# EAGLE design Noduino-iBaihe (EAGLE 6.6.0)
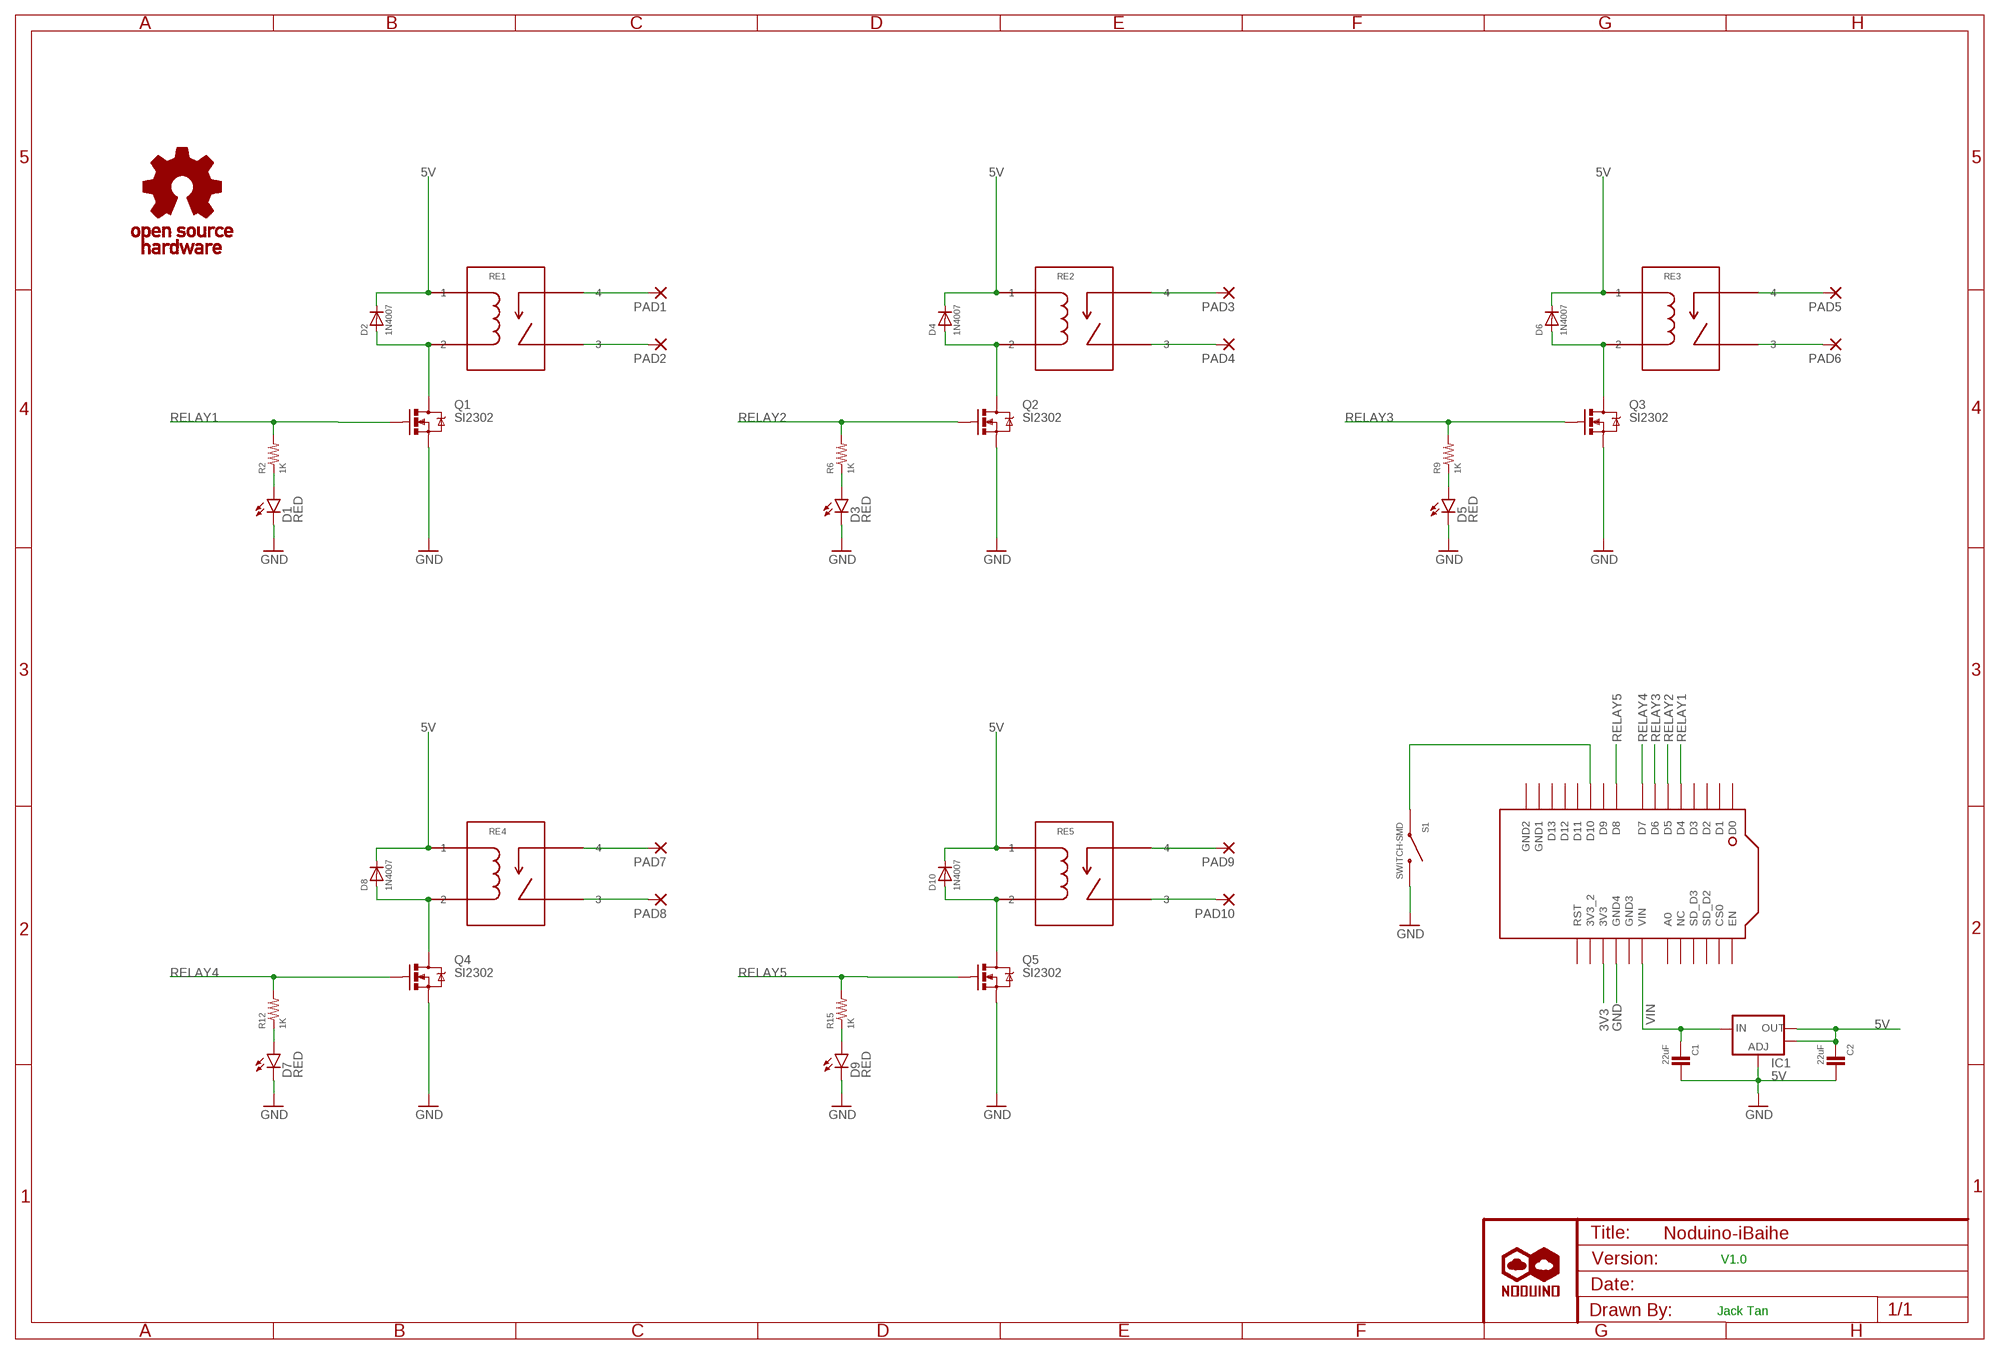
[diagram p0: schematic, sheet 1]

## Parts
C1  22uF  1206-CAP  [C1206]
C2  22uF  1206-CAP  [C1206]
D1  RED  LED-RED0603  [LED-0603]
D2  1N4007  DIODESOD  [SOD-323]
D3  RED  LED-RED0603  [LED-0603]
D4  1N4007  DIODESOD  [SOD-323]
D5  RED  LED-RED0603  [LED-0603]
D6  1N4007  DIODESOD  [SOD-323]
D7  RED  LED-RED0603  [LED-0603]
D8  1N4007  DIODESOD  [SOD-323]
D9  RED  LED-RED0603  [LED-0603]
D10  1N4007  DIODESOD  [SOD-323]
IC1  5V  AMS1117SOT223  [SOT223]
N1  NODUINO-PINMAIL  [NODUINO-PIN-MAIL]
PAD1  2,15/1,0  [2,15/1,0]
PAD2  2,15/1,0  [2,15/1,0]
PAD3  2,15/1,0  [2,15/1,0]
PAD4  2,15/1,0  [2,15/1,0]
PAD5  2,15/1,0  [2,15/1,0]
PAD6  2,15/1,0  [2,15/1,0]
PAD7  2,15/1,0  [2,15/1,0]
PAD8  2,15/1,0  [2,15/1,0]
PAD9  2,15/1,0  [2,15/1,0]
PAD10  2,15/1,0  [2,15/1,0]
Q1  SI2302  MOSFET-N-SMD  [SOT23-3]
Q2  SI2302  MOSFET-N-SMD  [SOT23-3]
Q3  SI2302  MOSFET-N-SMD  [SOT23-3]
Q4  SI2302  MOSFET-N-SMD  [SOT23-3]
Q5  SI2302  MOSFET-N-SMD  [SOT23-3]
R2  1K  0603-RESISTOR  [0603-RES]
R6  1K  0603-RESISTOR  [0603-RES]
R9  1K  0603-RESISTOR  [0603-RES]
R12  1K  0603-RESISTOR  [0603-RES]
R15  1K  0603-RESISTOR  [0603-RES]
RE1  HKE-HRS3FNH  [HKE-HRS3FN]
RE2  HKE-HRS3FNH  [HKE-HRS3FN]
RE3  HKE-HRS3FNH  [HKE-HRS3FN]
RE4  HKE-HRS3FNH  [HKE-HRS3FN]
RE5  HKE-HRS3FNH  [HKE-HRS3FN]
S1  SWITCH-SMD  [TACTILE-SWITCH-1101NE]
U$1  NODUINO-LOGO-ALL  [NODUINO-ALL-1]
U$2  OPEN_HARDWARE_LOGO  [OPEN_HARDWARE_LOGO]

## Nets
3V3: N1.P$26(3V3)
5V: C2.1 D2.1(C) D4.1(C) D6.1(C) D8.1(C) D10.1(C) IC1.2(OUT) IC1.4(OUT) RE1.1 RE2.1 RE3.1 RE4.1 RE5.1
GND: C1.2 C2.2 D1.C D3.C D5.C D7.C D9.C IC1.1(ADJ) N1.P$25(GND4) Q1.2(S) Q2.2(S) Q3.2(S) Q4.2(S) Q5.2(S) S1.P$1
N$2: D2.2(A) Q1.3(D) RE1.2
N$3: PAD1.1(P) RE1.4
N$4: D1.A R2.1
N$5: PAD2.1(P) RE1.3
N$7: D3.A R6.1
N$8: D4.2(A) Q2.3(D) RE2.2
N$9: PAD3.1(P) RE2.4
N$10: PAD4.1(P) RE2.3
N$12: D5.A R9.1
N$13: D6.2(A) Q3.3(D) RE3.2
N$14: PAD5.1(P) RE3.4
N$15: PAD6.1(P) RE3.3
N$17: D7.A R12.1
N$18: D8.2(A) Q4.3(D) RE4.2
N$19: PAD7.1(P) RE4.4
N$20: PAD8.1(P) RE4.3
N$22: D9.A R15.1
N$23: D10.2(A) Q5.3(D) RE5.2
N$24: PAD9.1(P) RE5.4
N$25: PAD10.1(P) RE5.3
N$29: N1.P$11(D10) S1.P$2
RELAY1: N1.P$5(D4) Q1.1(G) R2.2
RELAY2: N1.P$6(D5) Q2.1(G) R6.2
RELAY3: N1.P$7(D6) Q3.1(G) R9.2
RELAY4: N1.P$8(D7) Q4.1(G) R12.2
RELAY5: N1.P$9(D8) Q5.1(G) R15.2
VIN: C1.1 IC1.3(IN) N1.P$23(VIN)
Unconnected: N1.P$1(D0) N1.P$2(D1) N1.P$3(D2) N1.P$4(D3) N1.P$10(D9) N1.P$12(D11) N1.P$13(D12) N1.P$14(D13) N1.P$15(GND1) N1.P$16(GND2) N1.P$17(EN) N1.P$18(CS0) N1.P$19(SD_D2) N1.P$20(SD_D3) N1.P$21(NC) N1.P$22(A0) N1.P$24(GND3) N1.P$27(3V3_2) N1.P$28(RST)

## Notes on the sheet
- V1.0
- Jack Tan

## Library data of the parts
C1 C2 = ehl:1206-CAP
D1 D3 D5 D7 D9 = ehl:LED-RED: Assorted Red LEDs LilyPad 1206- DIO-09912 1206- DIO-00809 0603- DIO-00819; PROD_ID: DIO-00819
D2 D4 D6 D8 D10 = ehl:DIODE: Diode These are standard reverse protection diodes and small signal diodes. SMA package can handle up to about 1A. SOD-323 can handle about 200mA. What the SOD-323 package when ordering, there are some mfgs out there that are 5-pin packages.
IC1 = ehl:AMS1117: Voltage Regulator LM1117 Standard adjustable voltage regulator but in SMD form. Spark Fun Electronics SKU : COM-00595
N1 = ehl:NODUINO-PIN
PAD1-PAD10 = ehl:2,15/1,0: THROUGH-HOLE PAD
Q1-Q5 = ehl:MOSFET-N
R2 R6 R9 R12 R15 = ehl:0603-RESISTOR
RE1-RE5 = ehl:HKE-HRS3FNH
S1 = ehl:SWITCH-SMD
U$1 = ehl:NODUINO-LOGO-ALL
U$2 = ehl:OPEN_HARDWARE_LOGO

## Board
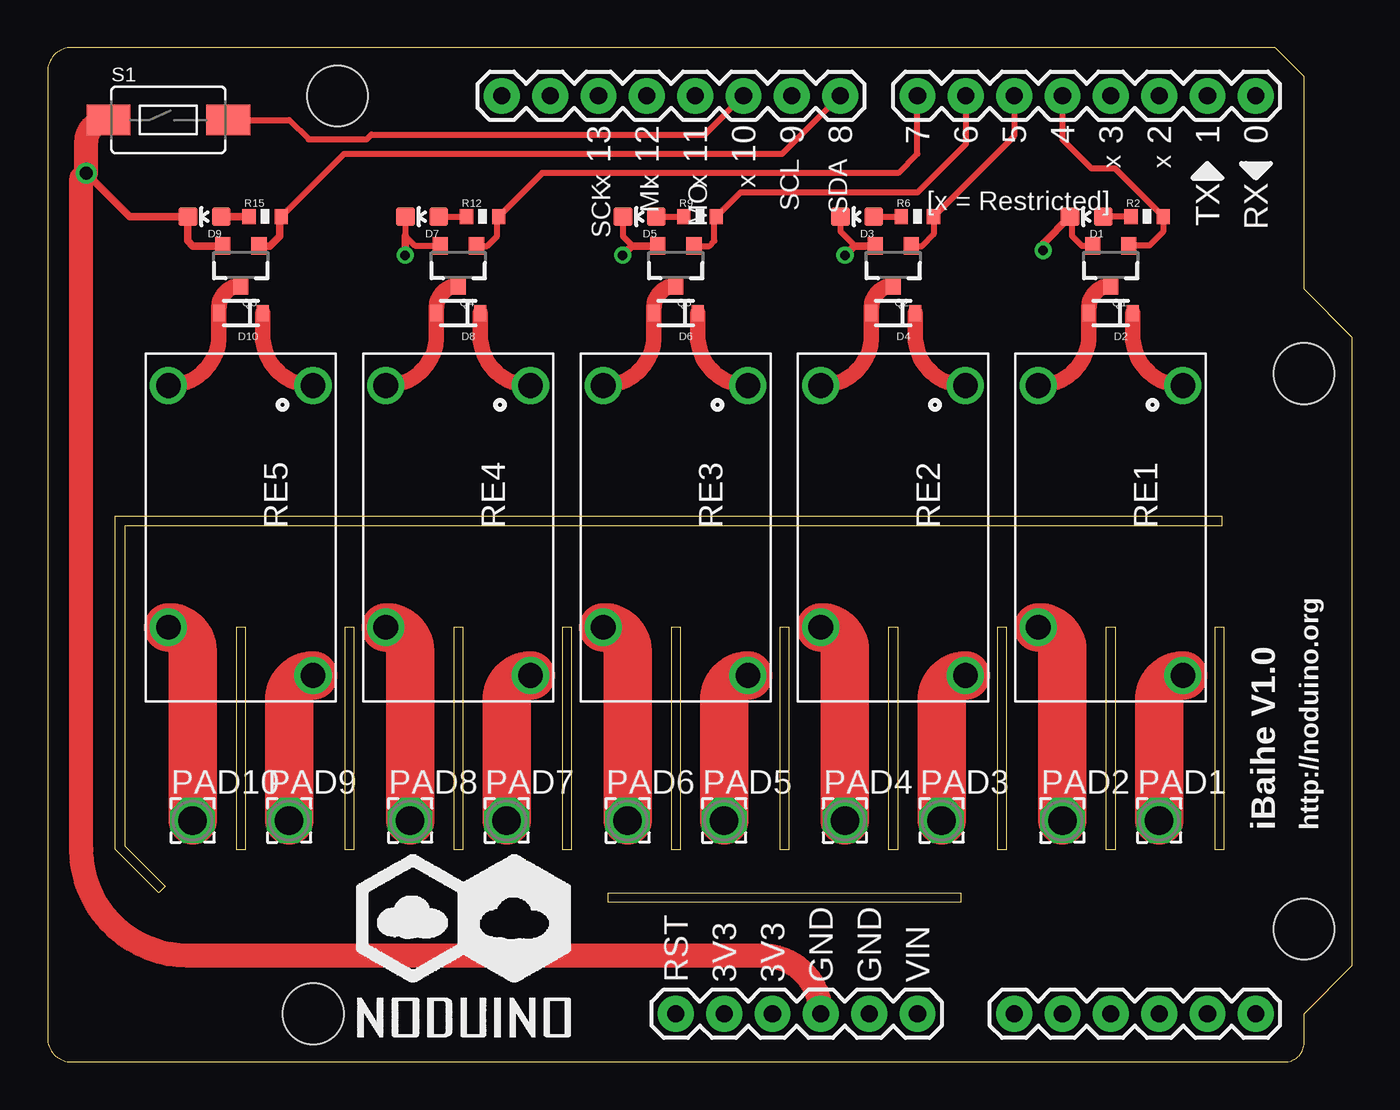
[diagram p1: board, top side]
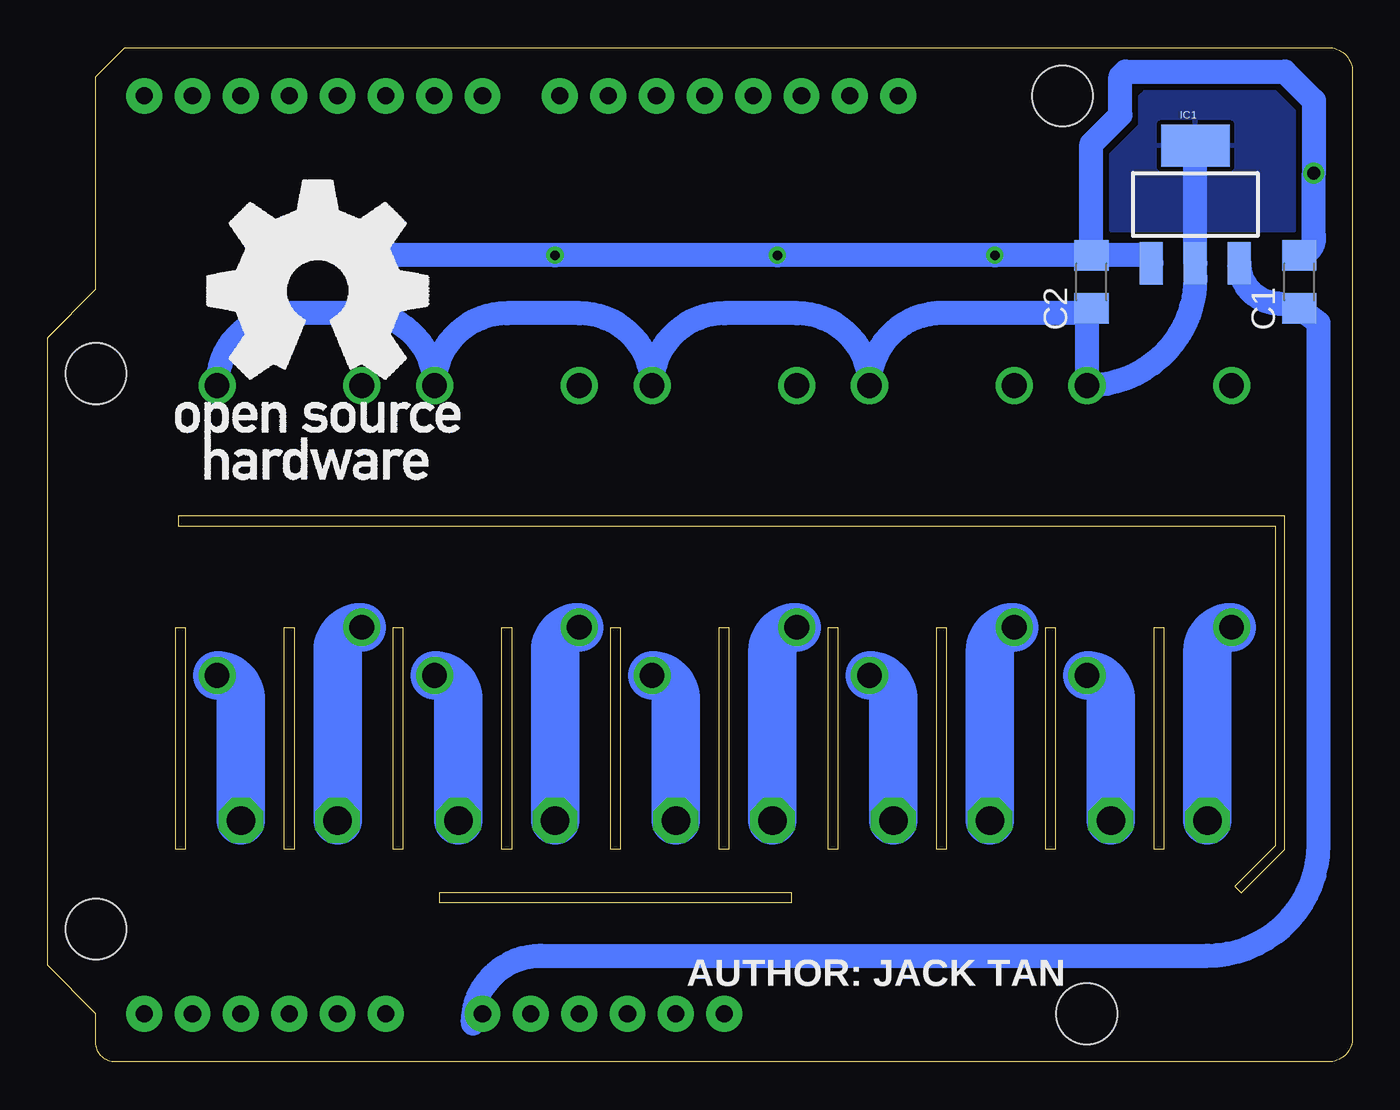
[diagram p2: board, bottom side, seen from below]

Size 68.58 x 53.34 mm. Coordinates in mm from the lower left corner, seen from the top.
Copper layers (1*16): Top 0.035mm / dielectric 1.5mm / Bottom 0.035mm
Design rules "jackslab-camgo": minimum track width 6mil, minimum drill 12mil, track to track 8mil, track to pad 8mil, pad to pad 8mil, via to via 8mil, smd to smd 6mil, copper to edge 8mil, drill to drill 8mil, minimum pad ring 10mil, minimum via ring 8mil, stop-mask expansion 4mil, vias tented up to drill 20mil, thermal gap 10mil
Milling: 52 lines

### Footprints (pad centres in the part's own frame; a part is rotated, then mirrored left to right if it is on the bottom)
C1206 = smd 1.6 x 1.8: 1 -1.4,0; 2 1.4,0
LED-0603 = smd 1 x 1: A 0,-0.877; C 0,0.877
SOD-323 = smd 0.63 x 0.83: 1 -1.15,0; 2 1.15,0
SOT223 = smd 1.219 x 2.235: 1 -2.311,-3.099; 2 0,-3.099; 3 2.311,-3.099 | smd 3.6 x 2.2: 4 0,3.099
NODUINO-PIN-MAIL = drill 0.9 pad 1.88: P$1 63.5,50.8; P$2 60.96,50.8; P$3 58.42,50.8; P$4 55.88,50.8; P$5 53.34,50.8; P$6 50.8,50.8; P$7 48.26,50.8; P$8 45.72,50.8; P$9 41.656,50.8; P$10 39.116,50.8; P$11 36.576,50.8; P$12 34.036,50.8; P$13 31.496,50.8; P$14 28.956,50.8; P$15 26.416,50.8; P$16 23.876,50.8; P$17 63.5,2.54; P$18 60.96,2.54; P$19 58.42,2.54; P$20 55.88,2.54; P$21 53.34,2.54; P$22 50.8,2.54; P$23 45.72,2.54; P$24 43.18,2.54; P$25 40.64,2.54; P$26 38.1,2.54; P$27 35.56,2.54; P$28 33.02,2.54 | hole 3.2: 66.04,6.985; 66.04,36.195; 15.24,50.8; 13.97,2.54
2,15/1,0 = drill 1.5 pad 2.35 octagon: 1 0,0
SOT23-3 = smd 0.8 x 0.9: 1 -0.95,-1; 2 0.95,-1; 3 0,1.1
0603-RES = smd 0.7 x 0.8: 1 -0.85,0; 2 0.85,0
HKE-HRS3FN = drill 1.3: 1 0,7.6; 2 0,0; 3 12.7,0; 4 15.24,7.6
TACTILE-SWITCH-1101NE = smd 2.3 x 1.6: P$1 -3.15,0; P$2 3.15,0

### Placement (x,y rotation side)
C1  2.79,41.02 90 bottom
C2  13.72,41.02 90 bottom
D1  54.61,44.45 90 top
D2  55.88,39.37 180 top
D3  42.55,44.45 90 top
D4  44.45,39.37 180 top
D5  31.11,44.45 90 top
D6  33.02,39.37 180 top
D7  19.68,44.45 90 top
D8  21.59,39.37 180 top
D9  8.26,44.45 90 top
D10  10.16,39.37 180 top
IC1  8.26,45.09 0 bottom
N1  0,0 0 top
PAD1  58.42,12.7 0 top
PAD2  53.34,12.7 0 top
PAD3  46.99,12.7 0 top
PAD4  41.91,12.7 0 top
PAD5  35.56,12.7 0 top
PAD6  30.48,12.7 0 top
PAD7  24.13,12.7 0 top
PAD8  19.05,12.7 0 top
PAD9  12.7,12.7 0 top
PAD10  7.62,12.7 0 top
Q1  55.88,41.91 180 top
Q2  44.45,41.91 180 top
Q3  33.02,41.91 180 top
Q4  21.59,41.91 180 top
Q5  10.16,41.91 180 top
R2  57.78,44.45 0 top
R6  45.72,44.45 0 top
R9  34.29,44.45 0 top
R12  22.86,44.45 0 top
R15  11.43,44.45 0 top
RE1  52.07,35.56 270 top
RE2  40.64,35.56 270 top
RE3  29.21,35.56 270 top
RE4  17.78,35.56 270 top
RE5  6.35,35.56 270 top
S1  6.35,49.53 0 top
U$1  15.88,0.64 0 top
U$2  61.87,30.62 0 bottom

### Tracks (layer width: path | path; a pad name or v marks a point on that pad's centre or on a via)
5V
  Top 0.813: D10.1 11.31,38.2 arc90 RE5.1 | D2.1 57.03,38.2 arc90 RE1.1 | D8.1 22.74,38.2 arc90 RE4.1 | D6.1 34.17,38.2 arc90 RE3.1 | D4.1 45.6,38.2 arc90 RE2.1
  Bottom 1.016: IC1.2 8.26,41.26
  Bottom 1.27: 8.26,41.26 arc90 RE5.1 13.95,39.39 | IC1.2 IC1.4 | 13.95,39.39 C2.1 | 13.95,39.39 21.55,39.39 arc-90 RE4.1 arc-90 29.19,39.37 33,39.37 arc-90 RE3.1 arc-90 40.62,39.37 44.43,39.37 arc-90 RE2.1 arc-90 52.05,39.37 55.86,39.37 arc-90 RE1.1
  pour Bottom: 3.05,43.69 12.7,43.69 12.7,47.75 11.18,49.28 11.18,50.8 10.92,51.05 4.06,51.05 3.05,50.04
GND  (via drill 0.5, 0.7)
  Top 0.305: Q1.2 54.37,42.91 53.85,43.43 53.85,44.34 D1.C | D3.C 41.67,43.68 42.42,42.93 43.48,42.93 Q2.2 | D7.C 18.81,43.42 19.3,42.93 20.62,42.93 Q4.2 | D5.C 30.24,43.42 30.73,42.93 32.05,42.93 Q3.2
  Top 0.406: v2.03,46.74 4.32,44.45 D9.C 7.37,44.44 7.37,43.18 7.64,42.91 Q5.2 | v52.32,42.67 52.32,43.04 D1.C | Q2.2 42.4,42.91 v41.91,42.42 | Q3.2 30.71,42.91 v30.23,42.42 | 18.81,43.42 18.81,42.43 v18.8,42.42
  Top 1.27: N1.P$25 arc90 37.59,5.59 7.37,5.59 arc-90 1.78,11.18 1.78,46.48 v2.03,46.74 2.03,48.36 arc-90 S1.P$1
  Bottom 1.27: C1.2 arc-90 2.03,43.44 v2.03,46.74 2.03,50.55 3.56,52.07 11.94,52.07 12.19,51.82 12.19,49.78 13.72,48.26 C2.2 | IC1.1 arc-90 11,42.42 C2.2 | C2.2 v18.8,42.42 v30.23,42.42 v41.91,42.42 52.07,42.42 v52.32,42.67
N$2
  Top 0.813: RE1.2 arc90 54.73,38.22 D2.2 54.73,39.66 arc-90 Q1.3
N$3
  Top 2.54: 59.69,20.32 arc90 58.42,19.05 PAD1.1
  Bottom 2.54: RE1.4 arc90 58.42,19.07 PAD1.1
N$4
  Top 0.305: R2.1 D1.A
N$5
  Top 2.54: RE1.3 arc-90 53.34,21.59 PAD2.1
  Bottom 2.54: RE1.3 arc-90 53.34,21.59 PAD2.1
N$7
  Top 0.305: D3.A R6.1
N$8
  Top 0.813: RE2.2 arc90 43.3,38.22 D4.2 43.3,39.66 arc-90 Q2.3
N$9
  Top 2.54: 48.26,20.32 arc90 46.99,19.05 PAD3.1
  Bottom 2.54: RE2.4 arc90 46.99,19.07 PAD3.1
N$10
  Top 2.54: RE2.3 arc-90 41.91,21.59 PAD4.1
  Bottom 2.54: RE2.3 arc-90 41.91,21.59 PAD4.1
N$12
  Top 0.305: D5.A R9.1
N$13
  Top 0.813: RE3.2 arc90 31.87,38.22 D6.2 31.87,39.66 arc-90 Q3.3
N$14
  Top 2.54: 36.83,20.32 arc90 35.56,19.05 PAD5.1
  Bottom 2.54: RE3.4 arc90 35.56,19.07 PAD5.1
N$15
  Top 2.54: RE3.3 arc-90 30.48,21.59 PAD6.1
  Bottom 2.54: RE3.3 arc-90 30.48,21.59 PAD6.1
N$17
  Top 0.305: D7.A R12.1
N$18
  Top 0.813: RE4.2 arc90 20.44,38.22 D8.2 20.44,39.66 arc-90 Q4.3
N$19
  Top 2.54: 25.4,20.32 arc90 24.13,19.05 PAD7.1
  Bottom 2.54: RE4.4 arc90 24.13,19.07 PAD7.1
N$20
  Top 2.54: RE4.3 arc-90 19.05,21.59 PAD8.1
  Bottom 2.54: RE4.3 arc-90 19.05,21.59 PAD8.1
N$22
  Top 0.406: D9.A R15.1
N$23
  Top 0.813: RE5.2 arc90 9.01,38.22 D10.2 9.01,39.66 arc-90 Q5.3
N$24
  Top 2.54: 13.97,20.32 arc90 12.7,19.05 PAD9.1
  Bottom 2.54: RE5.4 arc90 12.7,19.07 PAD9.1
N$25
  Top 2.54: RE5.3 arc-90 7.62,21.59 PAD10.1
  Bottom 2.54: RE5.3 arc-90 7.62,21.59 PAD10.1
N$29
  Top 0.305: S1.P$2 12.7,49.53 13.72,48.51 16.76,48.51 17.02,48.77 34.54,48.77 N1.P$11
RELAY1
  Top 0.305: Q1.1 56.85,42.93 57.91,42.93 58.63,43.65 R2.2 56.09,46.99 54.86,46.99 53.34,48.51 N1.P$5
RELAY2
  Top 0.305: N1.P$6 50.8,48.68 R6.2 46.57,43.52 45.96,42.91 Q2.1
RELAY3
  Top 0.305: N1.P$7 48.26,48.26 45.72,45.72 36.41,45.72 R9.2 35.05,44.36 35.05,43.18 34.78,42.91 Q3.1
RELAY4
  Top 0.305: Q4.1 23.1,42.91 23.62,43.43 23.62,44.36 R12.2 26,46.74 44.7,46.74 45.72,47.75 N1.P$8
RELAY5
  Top 0.305: R15.2 15.58,47.75 38.61,47.75 N1.P$9
  Top 0.406: Q5.1 11.67,42.91 12.19,43.43 12.19,44.36 R15.2
VIN
  Bottom 0.406: 5.86,41.91 5.86,41.93 6.1,42.16 6.1,42.14 IC1.3
  Bottom 1.27: N1.P$23 46.23,2.03 arc90 42.67,5.59 7.62,5.59 arc-90 1.78,11.43 1.78,38.86 C1.1 3.83,39.88 arc90 IC1.3

### Text on the board
tPlace: iBaihe V1.0 | http://noduino.org
bPlace: AUTHOR: JACK TAN